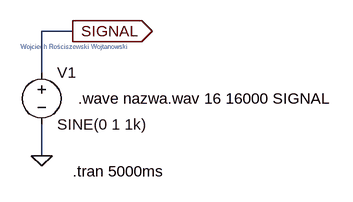
[diagram p0: schematic Saving WAV file.asc]
Saving WAV file.asc, the LTspice schematic file:
Version 4
SHEET 1 956 936
WIRE -304 32 -352 32
WIRE -352 96 -352 32
WIRE -352 224 -352 176
FLAG -352 224 0
FLAG -304 32 SIGNAL
IOPIN -304 32 Out
SYMBOL voltage -352 80 R0
WINDOW 123 0 0 Left 0
WINDOW 39 0 0 Left 0
SYMATTR InstName V1
SYMATTR Value SINE(0 1 1k)
TEXT -304 248 Left 2 !.tran 5000ms
TEXT -384 56 Left 0 ;Wojciech Rościszewski Wojtanowski
TEXT -296 136 Left 2 !.wave nazwa.wav 16 16000 SIGNAL

The netlist it stands for:
* Saving WAV file.asc
V1 SIGNAL 0 SINE(0 1 1k)
.tran 5000ms
* Wojciech Rościszewski Wojtanowski
.wave nazwa.wav 16 16000 SIGNAL
.backanno
.end